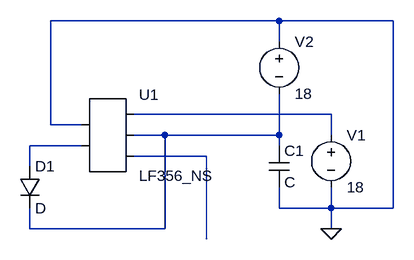
[diagram p0: schematic light_detector.asc]
light_detector.asc, the LTspice schematic file:
Version 4
SHEET 1 880 680
WIRE 496 -16 144 -16
WIRE 672 -16 496 -16
WIRE 496 16 496 -16
WIRE 576 128 272 128
WIRE 144 144 144 -16
WIRE 192 144 144 144
WIRE 320 160 272 160
WIRE 496 160 496 96
WIRE 496 160 320 160
WIRE 576 160 576 128
WIRE 192 176 112 176
WIRE 496 176 496 160
WIRE 384 192 272 192
WIRE 112 208 112 176
WIRE 496 272 496 240
WIRE 576 272 576 240
WIRE 576 272 496 272
WIRE 672 272 672 -16
WIRE 672 272 576 272
WIRE 112 304 112 272
WIRE 320 304 320 160
WIRE 320 304 112 304
WIRE 576 304 576 272
WIRE 384 320 384 192
FLAG 576 304 0
SYMBOL AutoGenerated\\LF356_NS 224 160 R0
SYMATTR InstName U1
SYMBOL voltage 576 144 R0
WINDOW 123 0 0 Left 0
WINDOW 39 0 0 Left 0
SYMATTR InstName V1
SYMATTR Value 18
SYMBOL voltage 496 0 R0
WINDOW 123 0 0 Left 0
WINDOW 39 0 0 Left 0
SYMATTR InstName V2
SYMATTR Value 18
SYMBOL diode 96 208 R0
SYMATTR InstName D1
SYMBOL cap 480 176 R0
SYMATTR InstName C1

The netlist it stands for:
* light_detector.asc
* U1: LF356_NS (symbol AutoGenerated\LF356_NS not available, pins judged from their places): pin1=0 pin2=N003 pin3=N001 pin4=N002 pin5=N004
V1 N001 0 18
V2 0 N002 18
D1 N003 N002 D
C1 N002 0 C
.model D D
.lib standard.dio
.backanno
.end